# Altium schematic sheet LiPo Charger.SchDoc
size A4; SheetNumber: 5; SheetTotal: 7
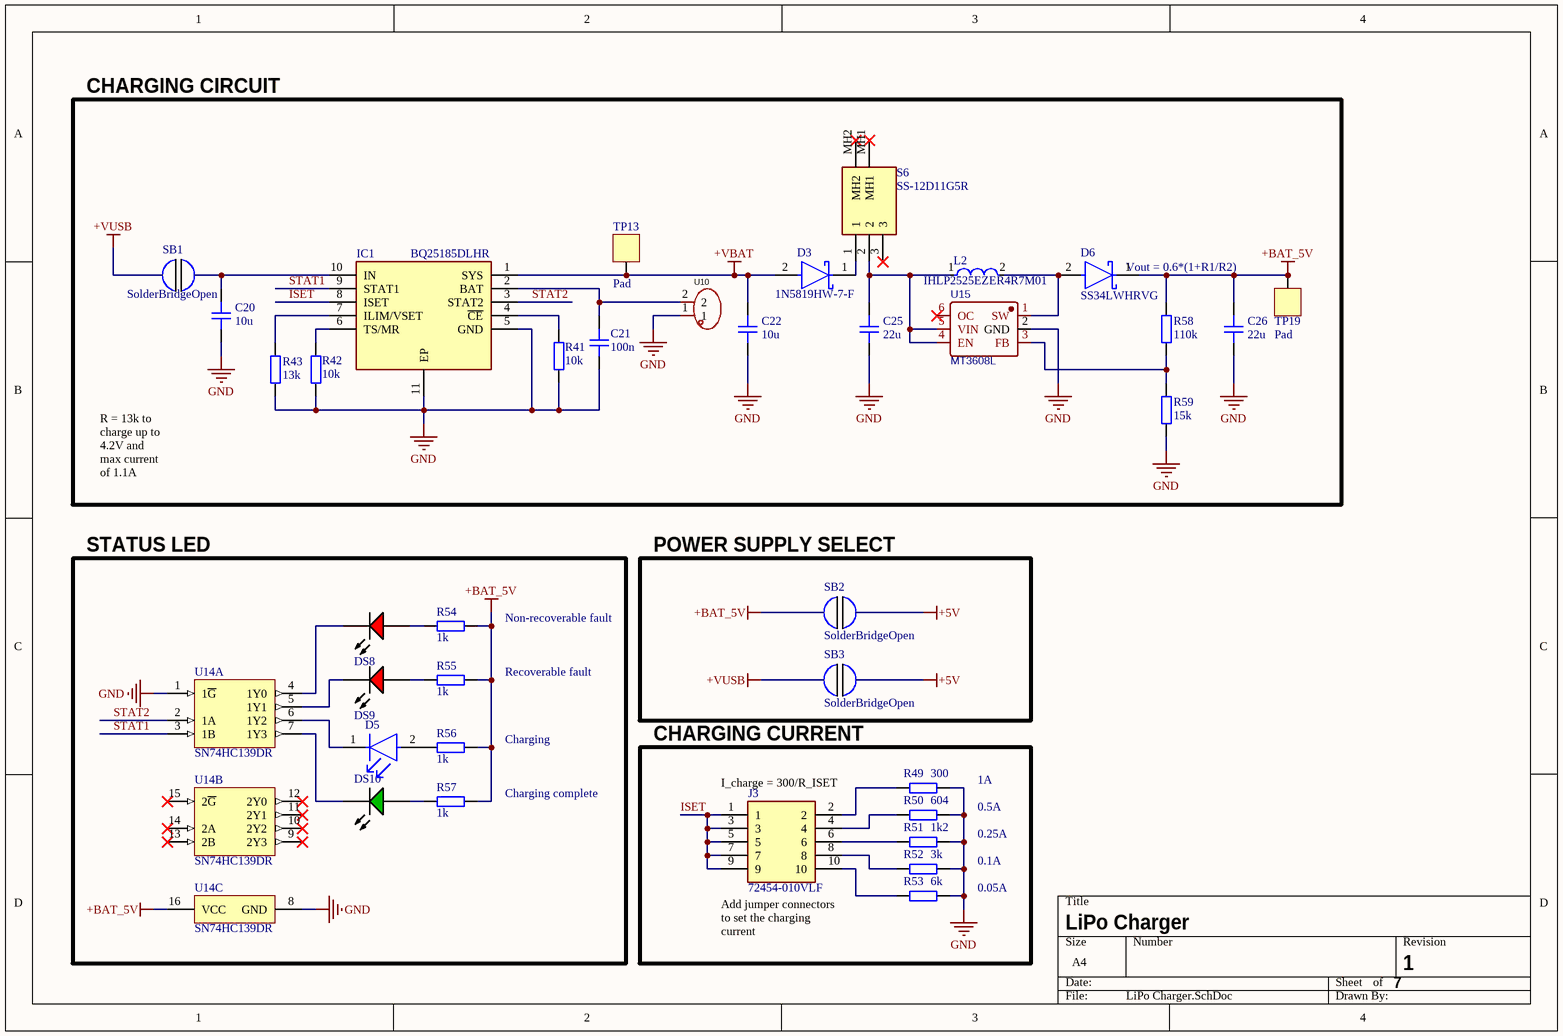
[diagram p0: LiPo Charger.SchDoc]

## Parts
C20  value 10u  [CAP_0402]  (hidden comment: CL05A106MQ5NUNC)
C21  Rating: 100n  [CAP_0402]  (hidden comment: CL05B104KB54PNC)
C22  value 10u  [CAP_0402]  (hidden comment: CL05A106MQ5NUNC)
C25  Rating: 22u  [CAP_0402]  (hidden comment: GRM158R61A226ME15D)
C26  Rating: 22u  [CAP_0402]  (hidden comment: GRM158R61A226ME15D)
D3  1N5819HW-7-F  [FP-SOD123-IPC_A]
D5  LTST-C170KFKT  [FP-LTST-C170KFKT-MFG]  (value not drawn)
D6  SS34LWHRVG  [FP-SS34LWH-MFG]
DS8  LTST-C170KRKT  [LTST-C170KRKT_V]  (value not drawn)
DS9  LTST-C170KRKT  [LTST-C170KRKT_V]  (value not drawn)
DS10  LTST-C170KGKT  [LTST-LTST-C170KGKT-2_V]  (value not drawn)
IC1  BQ25185DLHR  [SON40P220X200X80-11N]
J3  72454-010VLF  [72454010VLF]
L2  IHLP2525EZER4R7M01  [FP-IHLP-2525EZ-FP_2_413x3-MFG]
R41  value 10k  [RES_0402]  (hidden comment: 0402WGF1002TCE)
R42  value 10k  [RES_0402]  (hidden comment: 0402WGF1002TCE)
R43  Resistance: 13k  [RES_0603]  (hidden comment: 0603WAF1302T5E)
R49  Resistance: 300  [RES_0402]  (hidden comment: 0402WGF3000TCE)
R50  Resistance: 604  [RES_0402]  (hidden comment: CL0402FN604RP)
R51  Resistance: 1k2  [RES_0402]  (hidden comment: 0402WGF1201TCE)
R52  Resistance: 3k  [RES_0402]  (hidden comment: FRC0402F3001TS)
R53  Resistance: 6k  [RES_0402]  (hidden comment: RC0402FR-076K04L)
R54  value 1k  [RES_0402]  (hidden comment: 0402WGF1001TCE)
R55  value 1k  [RES_0402]  (hidden comment: 0402WGF1001TCE)
R56  value 1k  [RES_0402]  (hidden comment: 0402WGF1001TCE)
R57  value 1k  [RES_0402]  (hidden comment: 0402WGF1001TCE)
R58  value 110k  [RES_0402]  (hidden comment: RC0402FR-07110KL)
R59  value 15k  [RES_0402]  (hidden comment: 0402WGF1502TCE)
S6  SS-12D11G5R  [SS12D11G5R]
SB1  SolderBridgeOpen  [PCBComponent_1]
SB2  SolderBridgeOpen  [PCBComponent_1]
SB3  SolderBridgeOpen  [PCBComponent_1]
TP13  Pad  [PAD_SQ_2MM]  (no BOM)
TP19  Pad  [PAD_SQ_2MM]  (no BOM)
U10  DB125-3.81-2P-RD-S  [CONN-TH_DB125-3.81-2P-RD]  (value not drawn)
U14  SN74HC139DR  [D0016A_L]  (parts A,B,C of 3)
U15  MT3608L  [SOT-23-6_L2.9-W1.6-P0.95-LS2.8-BL_3]

## Blocks framed on the sheet
CHARGING CIRCUIT: C20-C22 C25 C26 D3 D6 IC1 L2 R41-R43 R58 R59 S6 SB1 TP13 TP19 U10 U15
STATUS LED: D5 DS8-DS10 R54-R57 U14
POWER SUPPLY SELECT: SB2 SB3
CHARGING CURRENT: J3 R49-R53

## Nets
+5V: SB2.2 SB3.2
+BAT_5V: C26.2 D6.1(C) R54.1 R55.1 R56.1 R57.1 R58.2 SB2.1 TP19.1 U14.16(VCC)
+VBAT: C22.2 D3.2(A) IC1.1(SYS) TP13.1
+VUSB: SB1.1 SB3.1
GND: C20.1 C21.2 C22.1 C25.1 C26.1 IC1.5(GND) IC1.11(EP) R41.1 R42.1 R43.1 R49.2 R50.2 R51.2 R52.2 R53.2 R59.1 U10.1 U14.1(1~{G}) U14.8(GND) U15.2(GND)
ISET: IC1.8(ISET) J3.1 J3.3 J3.5 J3.7 J3.9
STAT1: IC1.9(STAT1) U14.3(1B)
STAT2: IC1.3(STAT2) U14.2(1A)
NetC20_2: C20.2 IC1.10(IN) SB1.2
NetC21_1: C21.1 IC1.2(BAT) U10.2
NetC25_2: C25.2 L2.1 S6.2 U15.4(EN) U15.5(VIN)
NetD3_1: D3.1(C) S6.1
NetD5_1: D5.1(C) U14.6(1Y2)
NetD5_2: D5.2(A) R56.2
NetD6_2: D6.2(A) L2.2 U15.1(SW)
NetDS8_1: DS8.1(A) R54.2
NetDS8_2: DS8.2(K) U14.4(1Y0)
NetDS9_1: DS9.1(A) R55.2
NetDS9_2: DS9.2(K) U14.5(1Y1)
NetDS10_1: DS10.1(K) U14.7(1Y3)
NetDS10_2: DS10.2(A) R57.2
NetIC1_4: IC1.4(~{CE}) R41.2
NetIC1_6: IC1.6(TS/MR) R42.2
NetIC1_7: IC1.7(ILIM/VSET) R43.2
NetJ3_2: J3.2 R49.1
NetJ3_4: J3.4 R50.1
NetJ3_6: J3.6 R51.1
NetJ3_8: J3.8 R52.1
NetJ3_10: J3.10 R53.1
NetR58_1: R58.1 R59.2 U15.3(FB)

Not connected (* = marked no-connect by the designer): S6 3* MH1* MH2*; U14 9(2Y3)* 10(2Y2)* 11(2Y1)* 12(2Y0)* 13(2B)* 14(2A)* 15(2~{G})*; U15 6(OC)*

## Notes on the sheet
- (near D6) Vout = 0.6*(1+R1/R2)
- R = 13k to charge up to 4.2V and max current of 1.1A
- (near R54) Non-recoverable fault
- Recoverable fault
- (near R56) Charging
- (near J3) I_charge = 300/R_ISET
- 1A
- Charging complete
- 0.5A
- 0.25A
- 0.1A
- 0.05A
- (near J3) Add jumper connectors to set the charging current
- LiPo Charger
- 7
- 1

## Library data of the parts
C20-C22 C25 C26 = CAP_0402: Capacitor SMD 0402; Manufacturer: *; Manufacturer Part Number: *; Distributor Link: *; LCSC: *; Dielectric: *
D3 = CMP-0303-00003-3: DIODE SCHOTTKY 40V 1A SOD123; Forward Voltage: 450mV; Capacitance: 110pF; Max Forward Surge Current (Ifsm): 25A; Peak Reverse Current: 50uA; Polarity: Standard; Element Configuration: Single; Max Power Dissipation: 450mW; Min Operating Temperature: -65°C; Package Quantity: 3000; Contact Plating: Tin; Weight: 0.000353oz; Max Repetitive Reverse Voltage (Vrrm): 40V; Max Reverse Voltage (DC): 40V; Height: 1.25mm; Average Rectified Current: 1A; Width: 1.7mm; Case/Package: SOD-123-2; Lead Free: Lead Free; Max Operating Temperature: 125°C; Current Rating: 1A; Termination: SMD/SMT; Forward Current: 1A; Radiation Hardening: No; Number of Pins: 2; Length: 2.85mm; Voltage Rating (DC): 40V; REACH SVHC: No SVHC; Peak Non-Repetitive Surge Current: 25A; Packaging: Tape and Reel; Output Current: 1A
D5 = CMP-22017-000036-1: LED ORANGE CLEAR SMD; Forward Current: 30mA; Reverse Voltage: 5V; Forward Voltage: 2V; Lens Style: Diffused; Number of Elements: 1; Test Current: 20mA; Lens Color: Colorless; Viewing Angle: 130°; Dominant Wavelength: 605nm; Luminous Intensity: 60mcd; Power Rating: 75mW; Wavelength: 611nm; Min Operating Temperature: -55°C; Packaging: Tape and Reel; Case Code (Metric): 2012; Depth: 1.6mm; Case Code (Imperial): 0805; Mount: Surface Mount; Radiation Hardening: No; Lens Transparency: Clear; Color: Orange; Package Quantity: 1; Illumination Color: Orange; Lead Free: Lead Free; Number of LEDs: 1; Length: 3.2mm; Height: 1.1mm; Number of Pins: 2; Width: 1.25mm; Case/Package: 0805; Power Dissipation: 75mW; Max Operating Temperature: 85°C
D6 = CMP-15604-000001-1: DIODE SCHOTTKY 40V 3A SOD123W; RoHS Compliant: Yes
DS8 DS9 = CMP-2000-07593-1: LED Red, 75 mW, 54 mcd, -55 to 85 degC, 2-Pin SMD, RoHS, Tape and Reel; Manufacturer: Lite-On; Lens Transparency: Clear; Number of Elements: 1; Power Rating: 75mW; Luminous Intensity: 54mcd; Viewing Angle: 130degrees; Forward Current: 30mA; Wavelength: 639nm; Lens Style: Rectangular; Case\/Package: 0805; Test Current: 20mA; Dominant Wavelength: 631nm; Forward Voltage: 2V; Lens Colour: Colorless; Min Operating Temperature: -55degC; RoHSCompliant: True; Length: 3.2mm; Width: 1.25mm; Mount: SurfaceMount; Packaging: TapeandReel; Number of LEDs: 1; Radiation Hardening: No; Datasheet URL: http://optoelectronics.liteon.com/upload/download/DS-22-99-0150/LTST-C170KRKT.pdf; Datasheet Version: Rev. D, 11/2014; Case Code (Metric): 2012; Height: 1.1mm; Number of Pins: 2; Package Description: 2-Pin Surface Mount Device, Body 2 x 1.25 mm; Manufacturer URL: http://www.us.liteon.com/; Lead Free: LeadFree; Illumination Colour: Red; Colour: Red; Case Code (Imperial): 0805; Max Operating Temperature: 85degC; Power Dissipation: 75mW; Mounting Technology: SurfaceMount; Package Reference: C170KRKT; Package Quantity: 1; Depth: 1.6mm
DS10 = CMP-2000-06620-1: Ultra Bright AlInGaP Chip LED, 75 mW, -55 to 85 degC, 2-Pin SMD (0805), RoHS, Tape and Reel; Manufacturer: Lite-On; Forward Current: 30mA; Power Dissipation Max: 75mW; Emitting Color: YellowGreen; Type: Uni-Color; Forward Voltage: 2.4V; Dominant Wave Length: 571nm; Test Current (It): 20mA; Product Length (mm): 2mm; Peak Wavelength: 574nm; Power Dissipation: 75W; Product Depth (mm): 1.25mm; DELETED: Compliant; High Brightness: Yes; Product Height (mm): 1.1mm; Luminous Intensity: 35mcd; Shape Type: Rectangular; Chip Material: AlGaInP; Viewing Angle: 130deg; Number of  Elements: 1; Reverse Voltage: 5V; Rad Hardened: No; Package Type: ChipLed; Manufacturer URL: http://www.us.liteon.com/; Mounting: SurfaceMount; Operating Temp Range: -55Cto85C; Datasheet URL: http://optoelectronics.liteon.com/upload/download/DS22-2000-073/S_110_LTST-C170KGKT.pdf; Packaging: TapeandReel; Pin Count: 2; Package Description: 2-Pin Surface Mounted Device, Body 2 x 1.25 mm; Mounting Technology: SurfaceMount; Package Reference: LTST-C170KGKT-2; Forward Current Max: 30mA; Datasheet Version: Rev. G, 06/2005; Lens Dimensions: 1.4x1.25x0.6mm; Operating Temperature Classification: Industrial; Lum Intensity: 35mcd; Main Category: ChipLED
IC1 = BQ25185DLHR: Integrated Circuit; Manufacturer_Name: Texas Instruments; Datasheet Link: https://www.ti.com/lit/ds/symlink/bq25185.pdf?ts=1706857561339&ref_url=https%253A%252F%252Fwww.ti.com%252Fproduct%252FBQ25185; Height: 0.8mm; Manufacturer_Part_Number: BQ25185DLHR; Mouser Part Number: 595-BQ25185DLHR; Mouser Price/Stock: https://www.mouser.co.uk/ProductDetail/Texas-Instruments/BQ25185DLHR?qs=Z%252BL2brAPG1IbO%2FV3RqsaPw%3D%3D
J3 = 72454-010VLF: Connector; Manufacturer_Name: Amphenol; Datasheet Link: https://cdn.amphenol-cs.com/media/wysiwyg/files/drawing/72454.pdf; Height: 12.78mm; Manufacturer_Part_Number: 72454-010VLF; Mouser Part Number: 649-72454-010VLF; Mouser Price/Stock: https://www.mouser.co.uk/ProductDetail/Amphenol-FCI/72454-010VLF?qs=yJYkLTYh574QEF9%252BDEmzOw%3D%3D
L2 = CMP-02424-000065-1: Commercial Inductors, High Saturation Series 4.7uH 6.5A 30.3mΩ 20%; DC Resistance (DCR): 30.3mR; Saturation Current: 7A; Shielding: Shielded; Core Material: Ferrite; Self Resonant Frequency: 1MHz; Test Frequency: 100kHz; Number of Pins: 2; Case/Package: 2525; Lead Free: Lead Free; Depth: 6.72mm; Height - Seated (Max): 0.197inch; Mount: Surface Mount; Termination: SMD/SMT; Max Operating Temperature: 125°C; Inductance Tolerance: 20%; Military Standard: Not; Height: 5mm; RMS Current (Irms): 6.5A; Current Rating: 6.5A; Radiation Hardening: No; Package Quantity: 500; Packaging: Tape and Reel; Width: 0.255inch; Max DC Current: 6.5A; Length: 6.86mm; Min Operating Temperature: -55°C; Tolerance: 20%; Inductance: 4.7uH
R41 R42 R49-R59 = RES_0402: Resistor SMD 0402; Manufacturer: *; Manufacturer Part Number: *; Distributor Link: *; LCSC: *
R43 = RES_0603: Resistor SMD 0603; Manufacturer: *; Manufacturer Part Number: *; Distributor Link: *; LCSC: *
S6 = SS-12D11G5R: Switch; Manufacturer_Name: XKB Connectivity; Datasheet Link: http://www.helloxkb.com/public/images/pdf/SS-12D11XXX.pdf; Height: 6.9mm; Manufacturer_Part_Number: SS-12D11G5R
SB1-SB3 = SolderBridgeOpen: Close the brige with solder
TP13 TP19 = PAD_SQ_2MM: Test Point Square 2mm
U10 = DB125-3.81-2P-RD-S: Manufacturer: DORABO(地博电气); Add into BOM: yes; Number of Positions or Pins: 1x2P; Pitch: 3.81mm; Number of PINs Per Row: 2; Screw Specification: M2; Current Rating: 10A; Voltage Rating (Max): 300V; Wire Gauge - AWG: 16~26; Wire Gauge - mm2: 1; Symbol: DB125-3.81-2P-RD; Device: DB125-3.81-2P-RD-S; LCSC Part Name: 1x2P 3.81mm 直插 排数:1 每排P数:2; Supplier Part: C881703; Manufacturer Part: DB125-3.81-2P-RD-S; Supplier Footprint: 插件,P=3.81mm; JLCPCB Part Class: Extended Part; Datasheet: https://atta.szlcsc.com/upload/public/pdf/source/20220823/CB89165D0F406880B925A92BEEA3FB50.pdf; Supplier: LCSC; Convert to PCB: yes; Color: Red; Mounting Type: Through Hole; Number of Pins: 2P; Number of Rows: 1; Operating Temperature: -40℃~+105℃
U14 = CMP-1633-00245-2: Dual 2-Line To 4-Line Decoders/Demultiplexers, D0016A, LARGE T&R; Manufacturer: Texas Instruments; VCC(Max)(V): 6; F @ Nom Voltage(Max)(Mhz): 28; ICC @ Nom Voltage(Max)(mA): 0.08; Schmitt Trigger: No; Function: Decoder/Demultiplexer; tpd @ Nom Voltage(Max)(ns): 44; Input Type: LVTTL/CMOS; VCC(Min)(V): 2; Bits(#): 4; Output Drive (IOL/IOH)(Max)(mA): 5.2/-5.2; Configuration: 2：4; Output Type: CMOS; Rating: Catalog; Technology Family: HC; Voltage(Nom)(V): 3.3,5; Operating Temperature Range(C): -40 to 85; Code_JEDEC: MS-012 variation AC; Type: Standard; PackageReference: D0016A; Channels(#): 2; DatasheetVersion: SCLS108D; Generic Part Number: SN74HC139
U15 = MT3608L: Manufacturer: 西安航天民芯; Contributor: LCSC; Supplier: LCSC; Supplier Part: C2932326; Manufacturer Part: MT3608L; JLCPCB Part Class: Extended Part; spicePre: U; spiceSymbolName: MT3608L